# Altium schematic sheet main.SchDoc
size A2
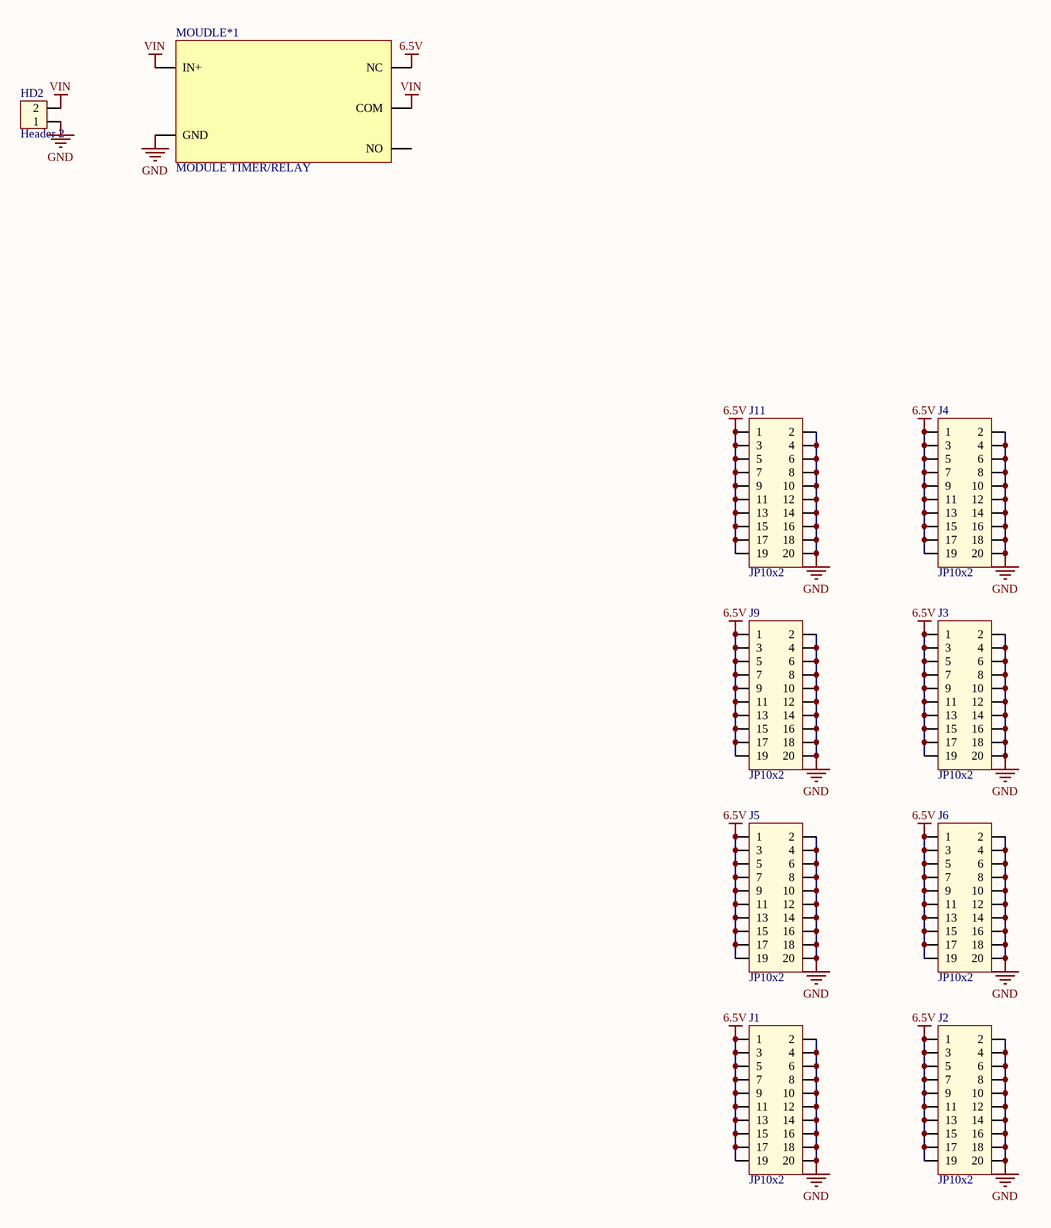
[diagram p0: main.SchDoc]

## Parts
HD2  Header 2  [HED2 -C]
J1  JP10x2  [JP10x2 - duplicate]
J2  JP10x2  [JP10x2 - duplicate]
J3  JP10x2  [JP10x2 - duplicate]
J4  JP10x2  [JP10x2 - duplicate]
J5  JP10x2  [JP10x2 - duplicate]
J6  JP10x2  [JP10x2 - duplicate]
J9  JP10x2  [JP10x2 - duplicate]
J11  JP10x2  [JP10x2 - duplicate]
MOUDLE*1  MODULE TIMER/RELAY  [MODULE TIMER/RELAY]

## Nets
6.5V: J1.1 J1.3 J1.5 J1.7 J1.9 J1.11 J1.13 J1.15 J1.17 J1.19 J2.1 J2.3 J2.5 J2.7 J2.9 J2.11 J2.13 J2.15 J2.17 J2.19 J3.1 J3.3 J3.5 J3.7 J3.9 J3.11 J3.13 J3.15 J3.17 J3.19 J4.1 J4.3 J4.5 J4.7 J4.9 J4.11 J4.13 J4.15 J4.17 J4.19 J5.1 J5.3 J5.5 J5.7 J5.9 J5.11 J5.13 J5.15 J5.17 J5.19 J6.1 J6.3 J6.5 J6.7 J6.9 J6.11 J6.13 J6.15 J6.17 J6.19 J9.1 J9.3 J9.5 J9.7 J9.9 J9.11 J9.13 J9.15 J9.17 J9.19 J11.1 J11.3 J11.5 J11.7 J11.9 J11.11 J11.13 J11.15 J11.17 J11.19 MOUDLE*1.NC
GND: HD2.1 J1.2 J1.4 J1.6 J1.8 J1.10 J1.12 J1.14 J1.16 J1.18 J1.20 J2.2 J2.4 J2.6 J2.8 J2.10 J2.12 J2.14 J2.16 J2.18 J2.20 J3.2 J3.4 J3.6 J3.8 J3.10 J3.12 J3.14 J3.16 J3.18 J3.20 J4.2 J4.4 J4.6 J4.8 J4.10 J4.12 J4.14 J4.16 J4.18 J4.20 J5.2 J5.4 J5.6 J5.8 J5.10 J5.12 J5.14 J5.16 J5.18 J5.20 J6.2 J6.4 J6.6 J6.8 J6.10 J6.12 J6.14 J6.16 J6.18 J6.20 J9.2 J9.4 J9.6 J9.8 J9.10 J9.12 J9.14 J9.16 J9.18 J9.20 J11.2 J11.4 J11.6 J11.8 J11.10 J11.12 J11.14 J11.16 J11.18 J11.20 MOUDLE*1.GND
VIN: HD2.2 MOUDLE*1.COM MOUDLE*1.IN+

Not connected (* = marked no-connect by the designer): MOUDLE*1 NO

## Library data of the parts
HD2 = Hed2: Header 2 (Green); Value: Header 2